# EAGLE design Fall_17_Workshop_Schem (EAGLE 8.4.1)
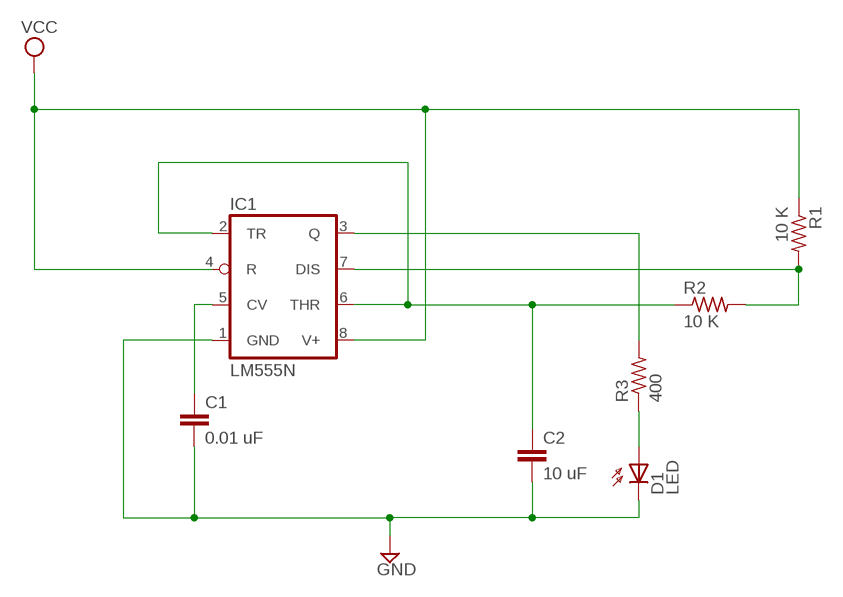
[diagram p0: schematic, sheet 1]

## Parts
C1  0.01 uF  C5/2.5  [C5B2.5]
C2  10 uF  C5/2.5  [C5B2.5]
D1  LED  SFH205  [SFH205]
IC1  LM555N  [DIL08]
R1  10 K  R-US_0204/7  [0204/7]
R2  10 K  R-US_0204/7  [0204/7]
R3  400  R-US_0204/7  [0204/7]

## Nets
GND: C1.2 C2.2 D1.K(C) IC1.1(GND)
N$1: C1.1 IC1.5(CV)
N$2: C2.1 IC1.2(TR) IC1.6(THR) R2.1
N$3: IC1.7(DIS) R1.2 R2.2
N$4: IC1.3(Q) R3.2
N$5: D1.A R3.1
VCC: IC1.4(R) IC1.8(V+) R1.1

## Library data of the parts
C1 C2 = capacitor-wima:C: CAPACITOR naming: grid - package width
D1 = opto-trans-siemens:SFH205: PHOTO DIODE; OC_FARNELL: unknown; OC_NEWARK: unknown
IC1 = linear:*555: TIMER
R1-R3 = rcl:R-US_: RESISTOR, American symbol

## Board
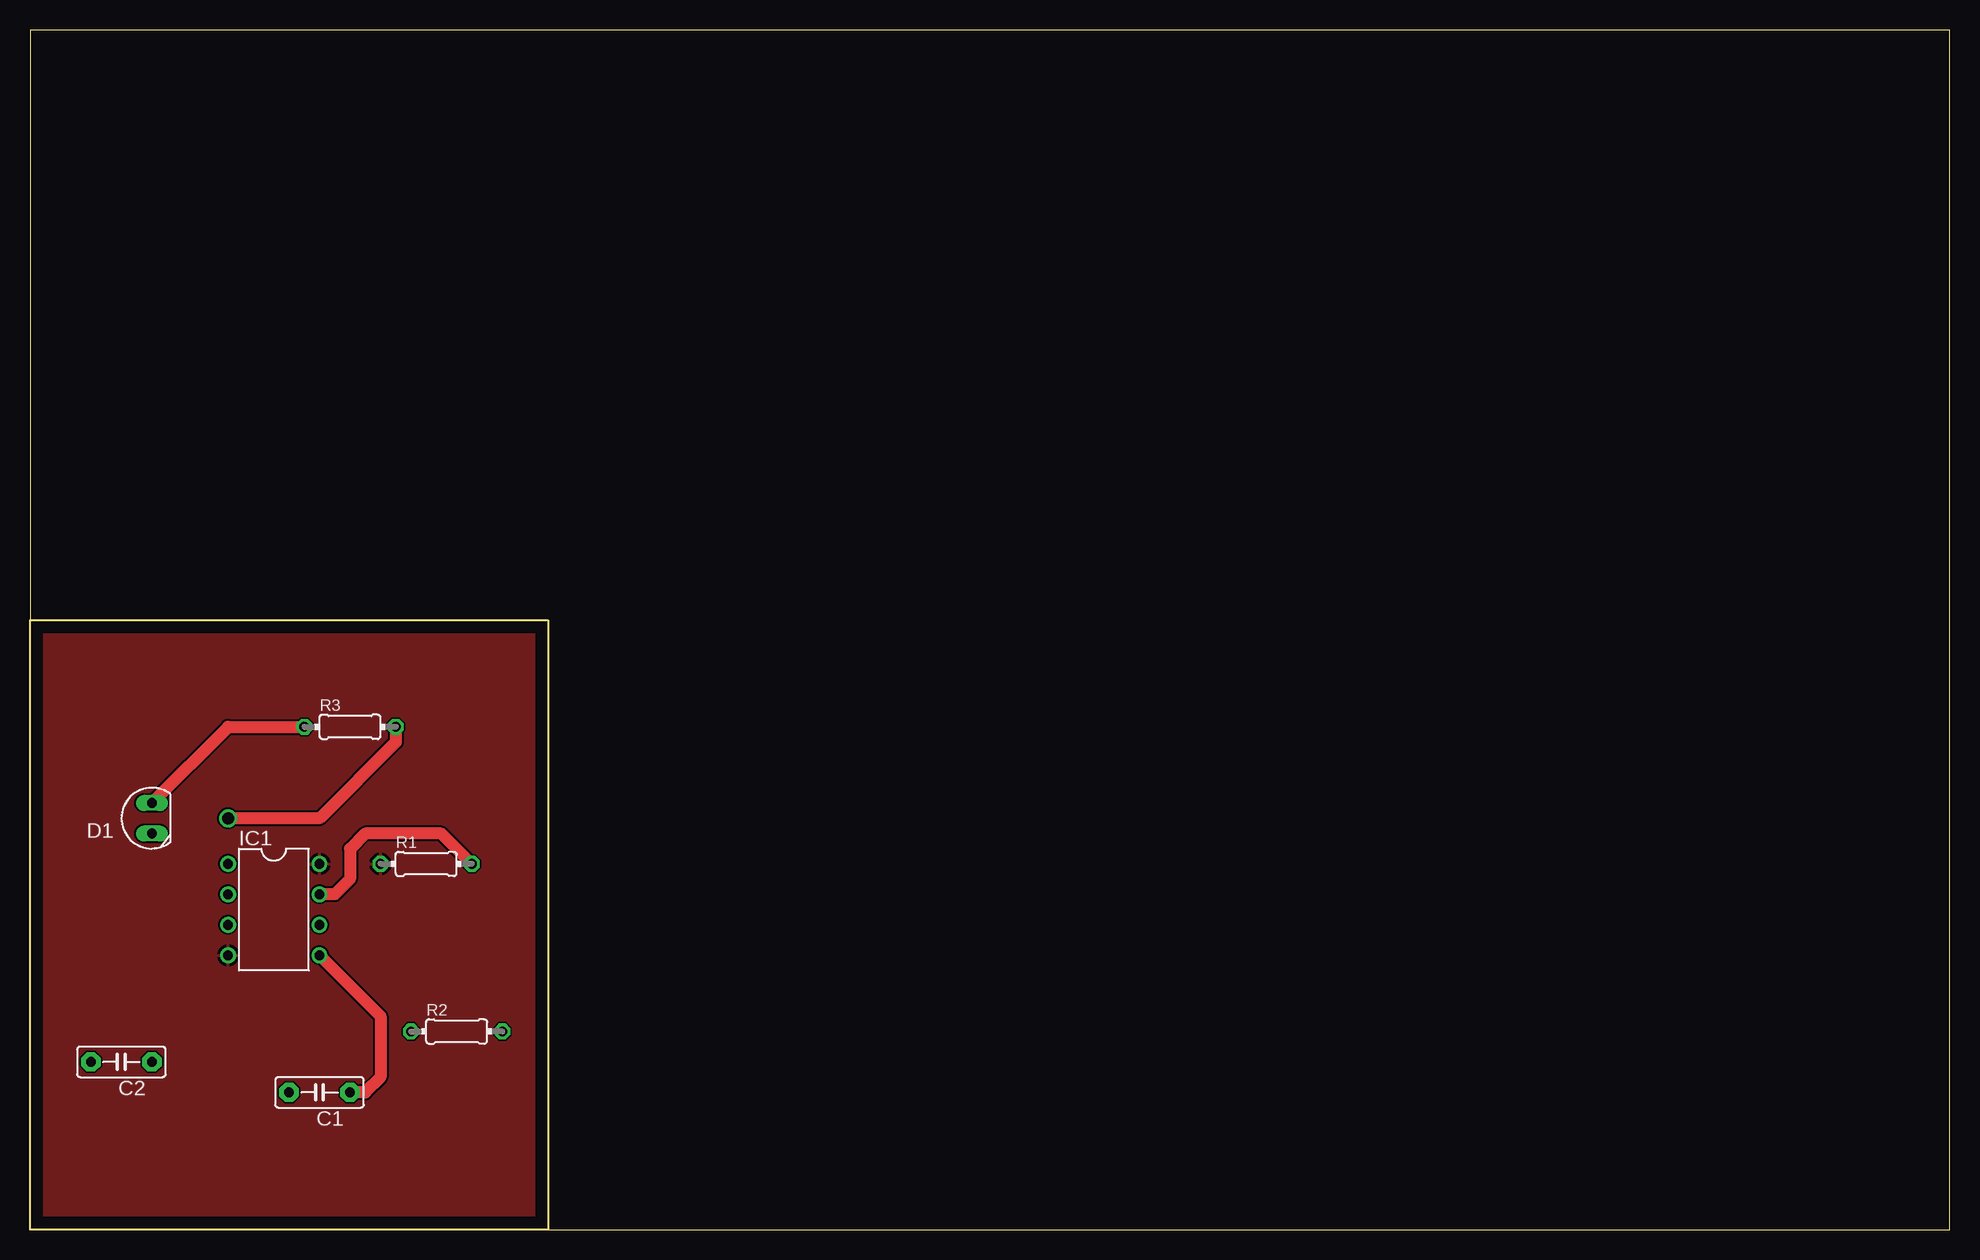
[diagram p1: board, top side]
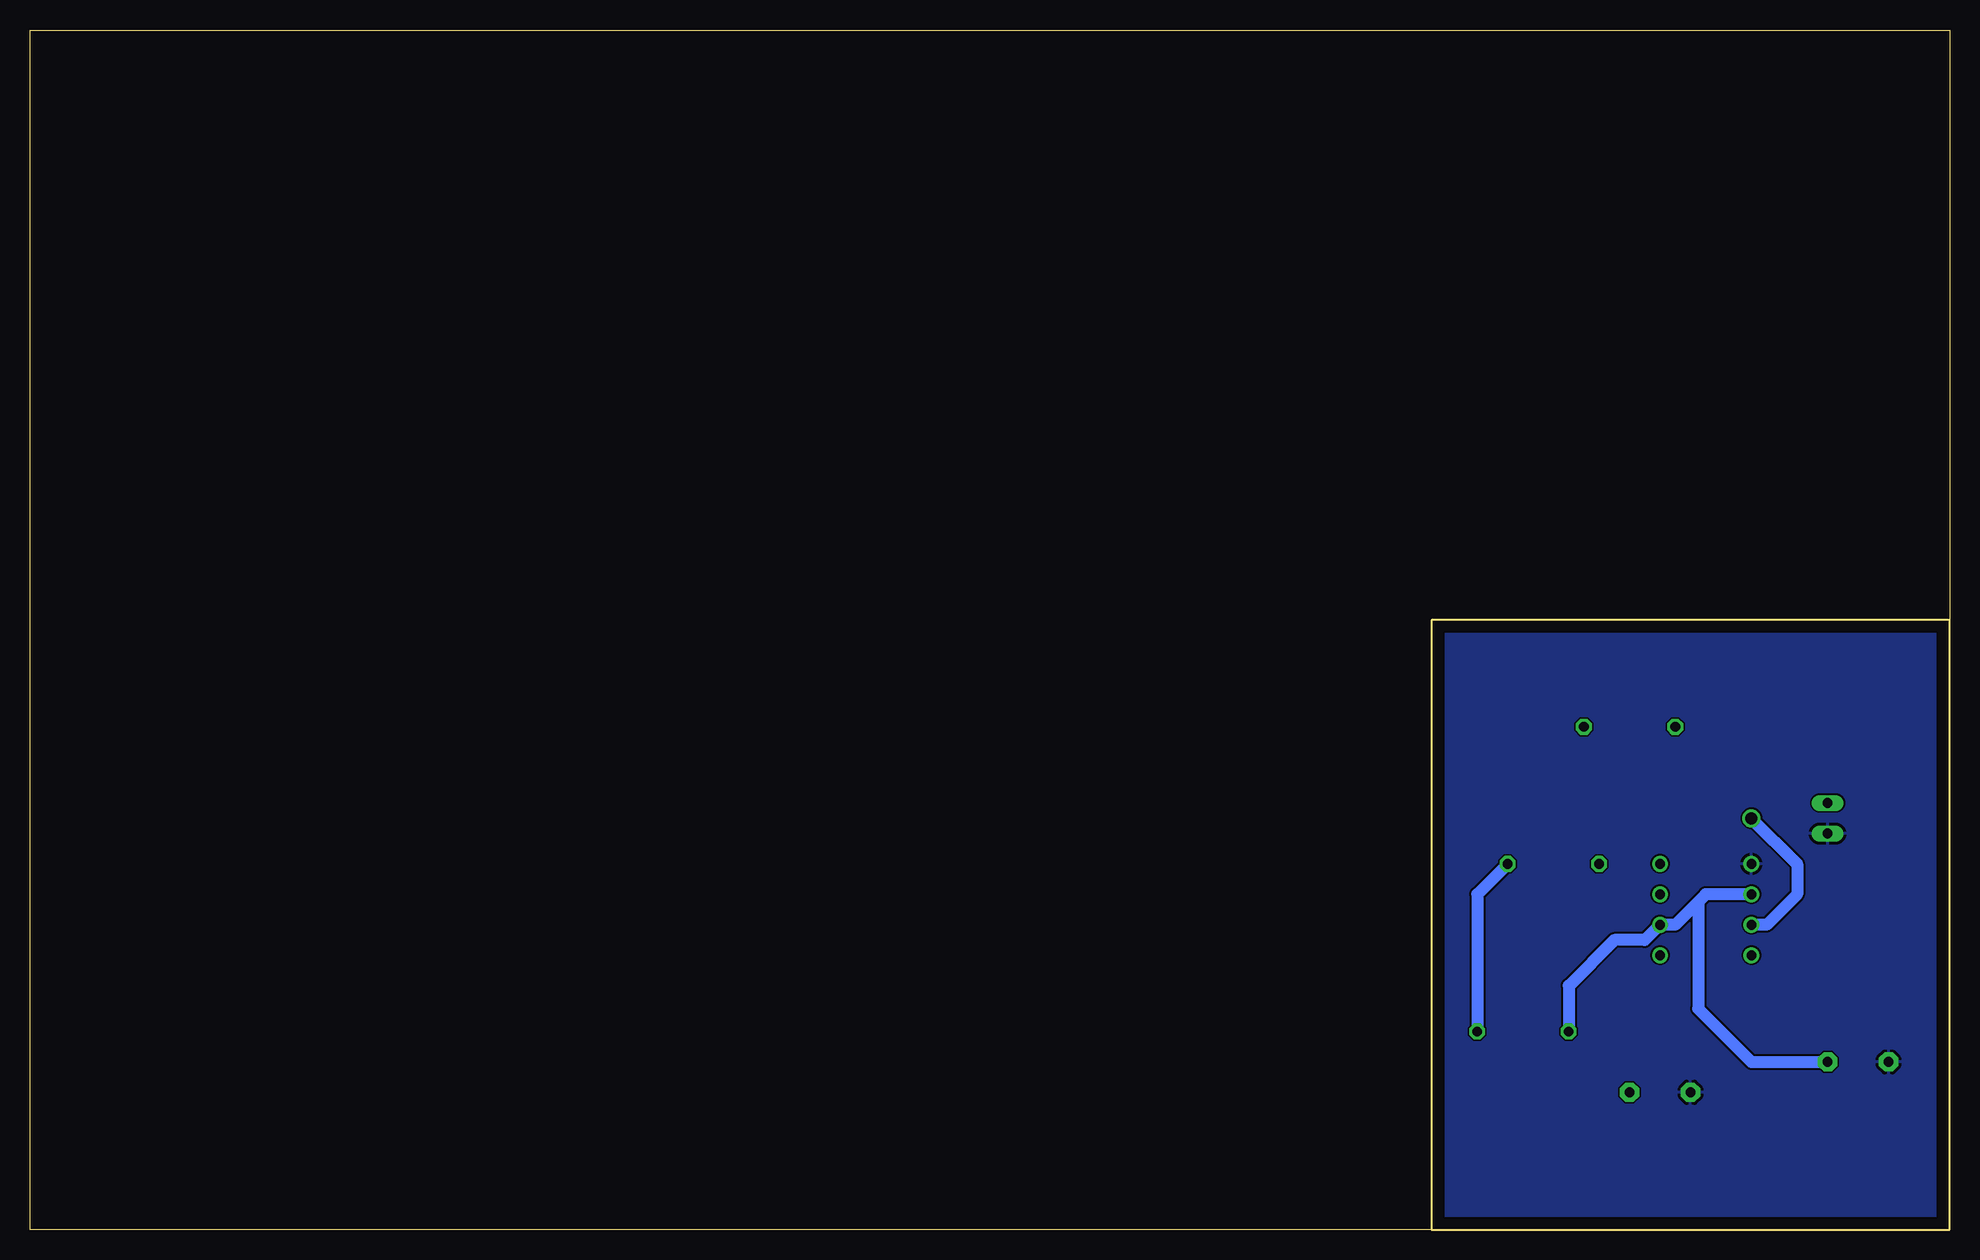
[diagram p2: board, bottom side, seen from below]

Size 160 x 100 mm. Coordinates in mm from the lower left corner, seen from the top.
Outline: 43.18,0 160,0 160,100 0,100 0,50.8
Outline: 0,50.8 43.18,50.8 43.18,0
Outline: 43.18,0 0,0 0,50.8
Copper layers (1*16): Top 0.035mm / dielectric 1.5mm / Bottom 0.035mm
Design rules "default": minimum track width 6mil, minimum drill 0.35mm, track to track 6mil, track to pad 6mil, pad to pad 6mil, via to via 6mil, smd to smd 6mil, copper to edge 40mil, drill to drill 6mil, minimum pad ring 10mil, minimum via ring 8mil, stop-mask expansion 4mil, vias tented up to drill 0mil, thermal gap 10mil

### Footprints (pad centres in the part's own frame; a part is rotated, then mirrored left to right if it is on the bottom)
C5B2.5 = drill 0.813 pad 1.6 octagon: 1 -2.54,0; 2 2.54,0
SFH205 = drill 0.813 long: A 0,-1.27; K 0,1.27
DIL08 = drill 0.813 pad 1.27: 1 -3.81,-3.81; 2 -1.27,-3.81; 3 1.27,-3.81; 4 3.81,-3.81; 5 3.81,3.81; 6 1.27,3.81; 7 -1.27,3.81; 8 -3.81,3.81
0204/7 = drill 0.813 octagon: 1 -3.81,0; 2 3.81,0

### Placement (x,y rotation side)
C1  24.13,11.43 180 top
C2  7.62,13.97 180 top
D1  10.16,34.29 180 top
IC1  20.32,26.67 270 top
R1  33.02,30.48 0 top
R2  35.56,16.51 0 top
R3  26.67,41.91 0 top

### Tracks (layer width: path | path; a pad name or v marks a point on that pad's centre or on a via)
GND
  pour Bottom: 0,50.8 0,0 43.18,0 43.18,50.8
N$1
  Top 1.016: IC1.5 29.21,17.78 29.21,12.7 27.94,11.43 C1.1
N$2
  Bottom 1.016: IC1.2 20.32,27.94 20.95,27.3 | 20.95,27.3 22.86,25.4 IC1.6 25.4,24.13 27.94,24.13 31.75,20.32 R2.1 | 20.95,27.3 20.95,18.41 16.51,13.97 C2.1
N$3
  Top 1.016: R1.2 34.29,33.02 27.94,33.02 26.67,31.75 26.67,29.21 25.4,27.94 IC1.7
  Bottom 1.016: R1.2 39.37,27.94 R2.2
N$4  (via drill 1)
  Top 1.016: R3.2 30.48,40.64 24.13,34.29 v16.51,34.29
  Bottom 1.016: v16.51,34.29 12.7,30.48 12.7,27.94 15.24,25.4 IC1.3
N$5
  Top 1.016: D1.A 16.51,41.91 R3.1
VCC
  pour Top: 0,50.8 0,0 43.18,0 43.18,50.8